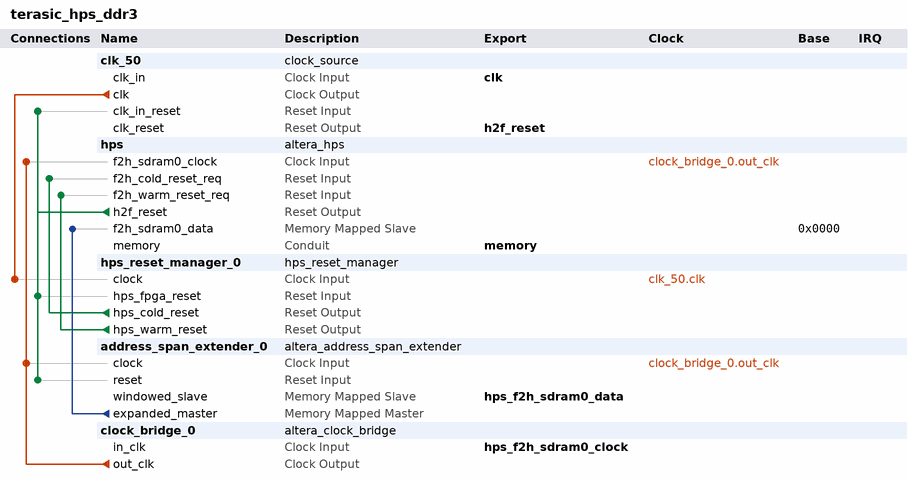
[diagram p0: system contents]
# Platform Designer (Qsys) system terasic_hps_ddr3, Cyclone V 5CSEBA6U23I7
# Parameters at their usual value, and those the tool derives, are not listed.
package require -exact qsys 18.1
create_system terasic_hps_ddr3
set_project_property DEVICE_FAMILY {Cyclone V}
set_project_property DEVICE 5CSEBA6U23I7

add_instance clk_50 clock_source 18.1
set_instance_parameter_value clk_50 clockFrequency 50000000

add_instance hps altera_hps 18.1
set_instance_parameter_value hps EMAC1_Mode N/A
set_instance_parameter_value hps EMAC1_PinMuxing Unused
set_instance_parameter_value hps F2SCLK_COLDRST_Enable true
set_instance_parameter_value hps F2SCLK_DBGRST_Enable false
set_instance_parameter_value hps F2SCLK_WARMRST_Enable true
set_instance_parameter_value hps F2SDRAM_Type {Avalon-MM Bidirectional}
set_instance_parameter_value hps F2SDRAM_Width 128
set_instance_parameter_value hps F2SINTERRUPT_Enable false
set_instance_parameter_value hps F2S_Width 0
set_instance_parameter_value hps FPGA_PERIPHERAL_OUTPUT_CLOCK_FREQ_EMAC0_GTX_CLK 100
set_instance_parameter_value hps FPGA_PERIPHERAL_OUTPUT_CLOCK_FREQ_EMAC0_MD_CLK 100.0
set_instance_parameter_value hps FPGA_PERIPHERAL_OUTPUT_CLOCK_FREQ_EMAC1_GTX_CLK 100
set_instance_parameter_value hps FPGA_PERIPHERAL_OUTPUT_CLOCK_FREQ_EMAC1_MD_CLK 100.0
set_instance_parameter_value hps HPS_PROTOCOL DDR3
set_instance_parameter_value hps I2C0_Mode N/A
set_instance_parameter_value hps I2C0_PinMuxing Unused
set_instance_parameter_value hps I2C1_Mode N/A
set_instance_parameter_value hps I2C1_PinMuxing Unused
set_instance_parameter_value hps LWH2F_Enable false
set_instance_parameter_value hps MEM_BANKADDR_WIDTH 3
set_instance_parameter_value hps MEM_CLK_FREQ 400.0
set_instance_parameter_value hps MEM_COL_ADDR_WIDTH 10
set_instance_parameter_value hps MEM_DQ_WIDTH 32
set_instance_parameter_value hps MEM_DRV_STR RZQ/6
set_instance_parameter_value hps MEM_ROW_ADDR_WIDTH 15
set_instance_parameter_value hps MEM_RTT_NOM RZQ/6
set_instance_parameter_value hps MEM_RTT_WR {Dynamic ODT off}
set_instance_parameter_value hps MEM_TCL 7
set_instance_parameter_value hps MEM_TFAW_NS 37.5
set_instance_parameter_value hps MEM_TRAS_NS 35.0
set_instance_parameter_value hps MEM_TRCD_NS 13.75
set_instance_parameter_value hps MEM_TRFC_NS 300.0
set_instance_parameter_value hps MEM_TRP_NS 13.75
set_instance_parameter_value hps MEM_VENDOR Other
set_instance_parameter_value hps MEM_WTCL 7
set_instance_parameter_value hps QSPI_Mode N/A
set_instance_parameter_value hps QSPI_PinMuxing Unused
set_instance_parameter_value hps REF_CLK_FREQ 25.0
set_instance_parameter_value hps S2FCLK_USER2CLK 1
set_instance_parameter_value hps S2F_Width 0
set_instance_parameter_value hps SDIO_Mode N/A
set_instance_parameter_value hps SDIO_PinMuxing Unused
set_instance_parameter_value hps SPIM1_Mode N/A
set_instance_parameter_value hps SPIM1_PinMuxing Unused
set_instance_parameter_value hps STM_Enable false
set_instance_parameter_value hps TIMING_BOARD_AC_SKEW 0.02
set_instance_parameter_value hps TIMING_BOARD_AC_TO_CK_SKEW 0.0
set_instance_parameter_value hps TIMING_BOARD_DQ_TO_DQS_SKEW 0.0
set_instance_parameter_value hps TIMING_BOARD_MAX_CK_DELAY 0.6
set_instance_parameter_value hps TIMING_BOARD_MAX_DQS_DELAY 0.6
set_instance_parameter_value hps TIMING_BOARD_SKEW_BETWEEN_DQS 0.02
set_instance_parameter_value hps TIMING_BOARD_SKEW_CKDQS_DIMM_MAX 0.01
set_instance_parameter_value hps TIMING_BOARD_SKEW_CKDQS_DIMM_MIN -0.01
set_instance_parameter_value hps TIMING_BOARD_SKEW_WITHIN_DQS 0.02
set_instance_parameter_value hps TIMING_TDH 125
set_instance_parameter_value hps TIMING_TDQSCK 400
set_instance_parameter_value hps TIMING_TDQSQ 120
set_instance_parameter_value hps TIMING_TDS 50
set_instance_parameter_value hps TIMING_TIH 250
set_instance_parameter_value hps TIMING_TIS 175
set_instance_parameter_value hps TIMING_TQSH 0.38
set_instance_parameter_value hps UART0_Mode N/A
set_instance_parameter_value hps UART0_PinMuxing Unused
set_instance_parameter_value hps USB1_Mode N/A
set_instance_parameter_value hps USB1_PinMuxing Unused
set_instance_parameter_value hps desired_cfg_clk_mhz 100.0
set_instance_parameter_value hps desired_qspi_clk_mhz 370.0

add_instance hps_reset_manager_0 hps_reset_manager 1.0

add_instance address_span_extender_0 altera_address_span_extender 18.1
set_instance_parameter_value address_span_extender_0 BURSTCOUNT_WIDTH 9
set_instance_parameter_value address_span_extender_0 DATA_WIDTH 128
set_instance_parameter_value address_span_extender_0 ENABLE_SLAVE_PORT false
set_instance_parameter_value address_span_extender_0 MASTER_ADDRESS_DEF 0
set_instance_parameter_value address_span_extender_0 MAX_PENDING_READS 1
set_instance_parameter_value address_span_extender_0 SLAVE_ADDRESS_WIDTH 26

add_instance clock_bridge_0 altera_clock_bridge 18.1
set_instance_parameter_value clock_bridge_0 DERIVED_CLOCK_RATE 0
set_instance_parameter_value clock_bridge_0 EXPLICIT_CLOCK_RATE 0

# connections
add_connection clk_50.clk hps_reset_manager_0.clock clock
add_connection clock_bridge_0.out_clk address_span_extender_0.clock clock
add_connection clock_bridge_0.out_clk hps.f2h_sdram0_clock clock
add_connection hps.h2f_reset address_span_extender_0.reset reset
add_connection hps.h2f_reset clk_50.clk_in_reset reset
add_connection hps.h2f_reset hps_reset_manager_0.hps_fpga_reset reset
add_connection hps_reset_manager_0.hps_cold_reset hps.f2h_cold_reset_req reset
add_connection hps_reset_manager_0.hps_warm_reset hps.f2h_warm_reset_req reset
add_connection address_span_extender_0.expanded_master hps.f2h_sdram0_data avalon
set_connection_parameter_value address_span_extender_0.expanded_master/hps.f2h_sdram0_data baseAddress 0x0000

# exported interfaces
add_interface clk clock sink
set_interface_property clk EXPORT_OF clk_50.clk_in
add_interface h2f_reset reset source
set_interface_property h2f_reset EXPORT_OF clk_50.clk_reset
add_interface hps_f2h_sdram0_clock clock sink
set_interface_property hps_f2h_sdram0_clock EXPORT_OF clock_bridge_0.in_clk
add_interface hps_f2h_sdram0_data avalon slave
set_interface_property hps_f2h_sdram0_data EXPORT_OF address_span_extender_0.windowed_slave
add_interface memory conduit end
set_interface_property memory EXPORT_OF hps.memory

set_interconnect_requirement {$system} qsys_mm.clockCrossingAdapter HANDSHAKE
set_interconnect_requirement {$system} qsys_mm.maxAdditionalLatency 1

save_system terasic_hps_ddr3.qsys
